# EAGLE schematic teplomer (EAGLE 7.5.0)
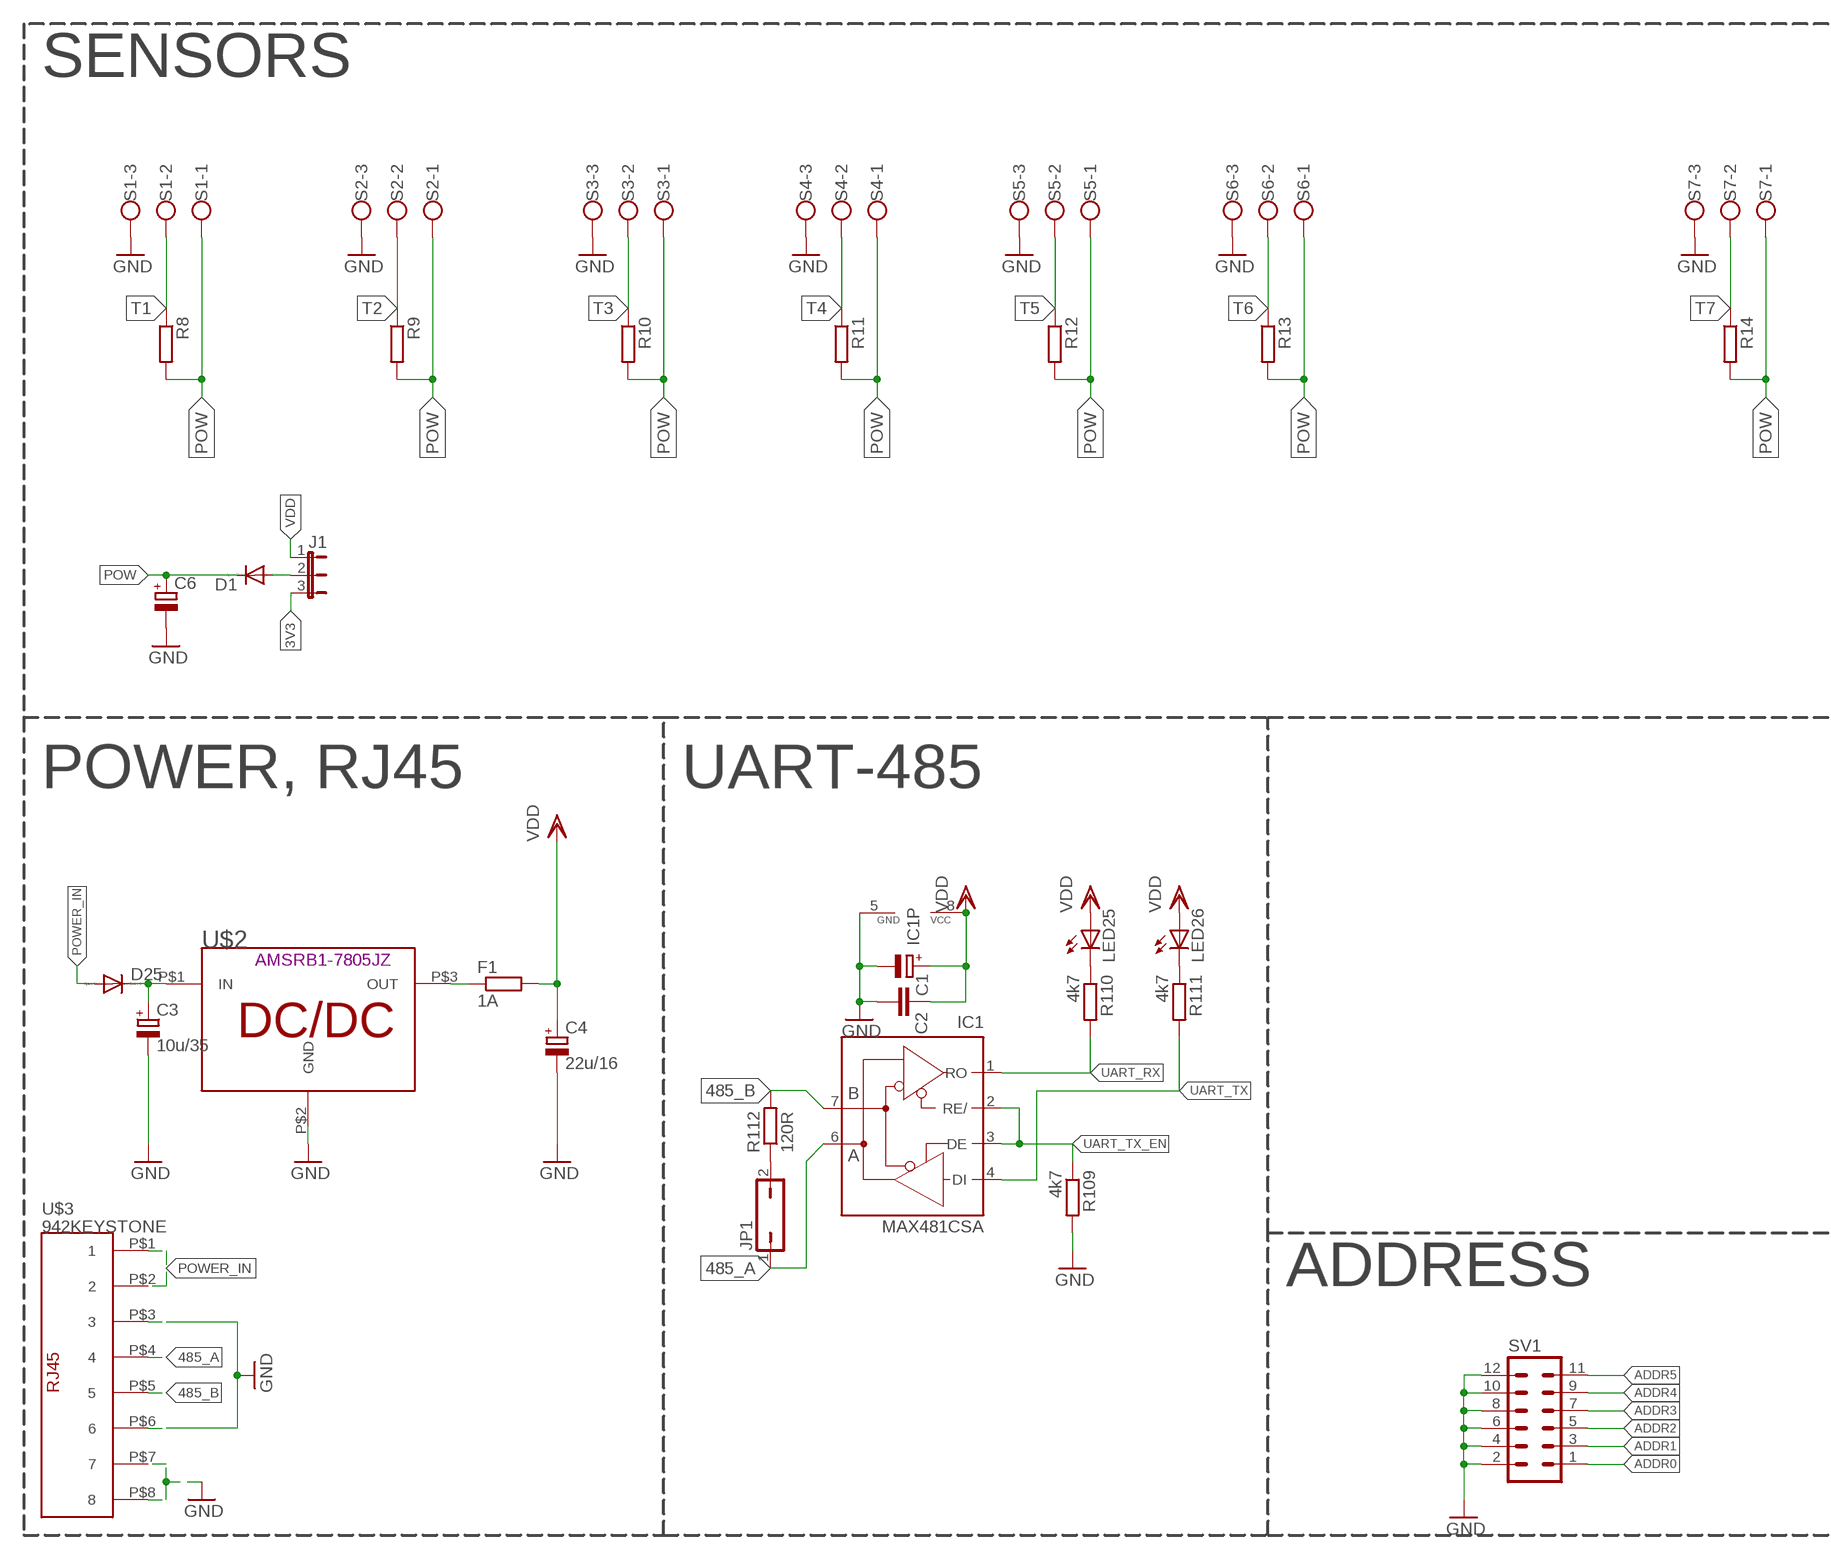
[diagram p0: schematic, sheet 1, part 1 of 2]
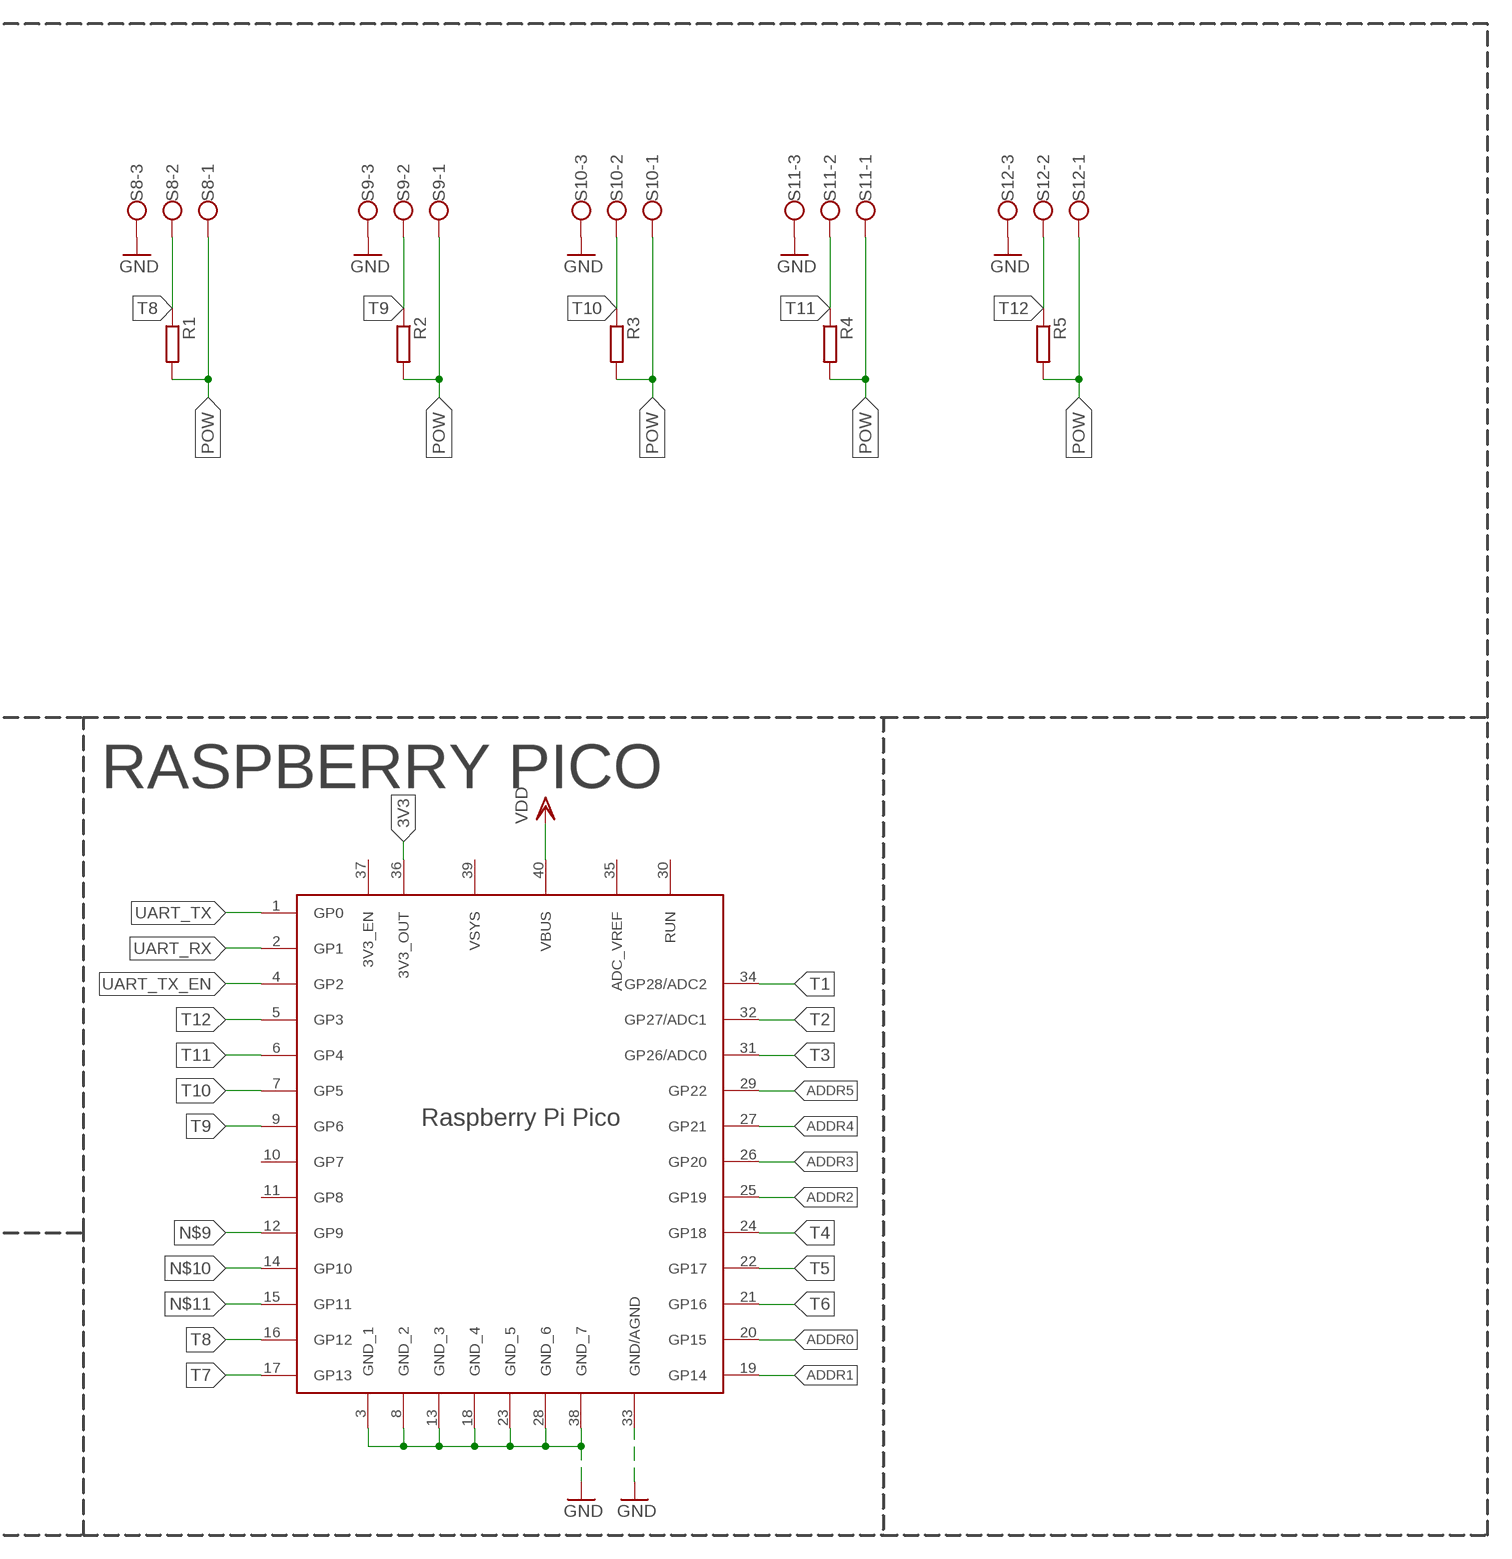
[diagram p1: schematic, sheet 1, part 2 of 2]

## Parts
C1  CPOL-EUCT3528  [CT3528]
C2  C-EUC1206  [C1206]
C3  10u/35  CPOL-EUE3.5-8  [E3,5-8]
C4  22u/16  CPOL-EUE2.5-7  [E2,5-7]
C6  CPOL-EUCT3528  [CT3528]
D1  DIODE-DO-214AC  [DO-214AC]
D25  DIODE-DO-214AC  [DO-214AC]
F1  1A  R-EU_R2512  [R2512]
IC1  MAX481CSA  [SO08]
J1  JP2W  [JP2W]
JP1  JP1Q  [JP1]
LED25  LEDKA-3528ASYC  [KA-3528ASYC]
LED26  LEDKA-3528ASYC  [KA-3528ASYC]
R1  R-EU_R0805  [R0805]
R2  R-EU_R0805  [R0805]
R3  R-EU_R0805  [R0805]
R4  R-EU_R0805  [R0805]
R5  R-EU_R0805  [R0805]
R8  R-EU_R0805  [R0805]
R9  R-EU_R0805  [R0805]
R10  R-EU_R0805  [R0805]
R11  R-EU_R0805  [R0805]
R12  R-EU_R0805  [R0805]
R13  R-EU_R0805  [R0805]
R14  R-EU_R0805  [R0805]
R109  4k7  R-EU_M1206  [M1206]
R110  4k7  R-EU_M1206  [M1206]
R111  4k7  R-EU_M1206  [M1206]
R112  120R  R-EU_M1206  [M1206]
S1  W237-103  [W237-103]
S2  W237-103  [W237-103]
S3  W237-103  [W237-103]
S4  W237-103  [W237-103]
S5  W237-103  [W237-103]
S6  W237-103  [W237-103]
S7  W237-103  [W237-103]
S8  W237-103  [W237-103]
S9  W237-103  [W237-103]
S10  W237-103  [W237-103]
S11  W237-103  [W237-103]
S12  W237-103  [W237-103]
SV1  MA06-2  [MA06-2]
U$1  RASPBERRY_PI_PICO  [RASPBERRY_PI_PICO]
U$2  AIMTEC  [AIMTEC]
U$3  942KEYSTONE  RJ45  [RJ45]

## Nets
3V3: J1.3 U$1.36(3V3_OUT)
485_A: IC1.6(A) JP1.1 U$3.P$4
485_B: IC1.7(B) R112.2 U$3.P$5
ADDR0: SV1.1 U$1.20(GP15)
ADDR1: SV1.3 U$1.19(GP14)
ADDR2: SV1.5 U$1.25(GP19)
ADDR3: SV1.7 U$1.26(GP20)
ADDR4: SV1.9 U$1.27(GP21)
ADDR5: SV1.11 U$1.29(GP22)
GND: C1.- C2.2 C3.- C4.- C6.- IC1.5(GND) R109.2 S1.3 S2.3 S3.3 S4.3 S5.3 S6.3 S7.3 S8.3 S9.3 S10.3 S11.3 S12.3 SV1.2 SV1.4 SV1.6 SV1.8 SV1.10 SV1.12 U$1.3(GND_1) U$1.8(GND_2) U$1.13(GND_3) U$1.18(GND_4) U$1.23(GND_5) U$1.28(GND_6) U$1.33(GND/AGND) U$1.38(GND_7) U$2.P$2(GND) U$3.P$3 U$3.P$7 U$3.P$8
N$1: C3.+ D25.C U$2.P$1(IN)
N$2: D1.A J1.2
N$9: U$1.12(GP9)
N$10: U$1.14(GP10)
N$11: U$1.15(GP11)
N$133: LED25.C R110.1
N$134: LED26.C R111.1
N$135: F1.1 U$2.P$3(OUT)
N$136: JP1.2 R112.1
N$138: U$3.P$6
POW: C6.+ D1.C R1.2 R2.2 R3.2 R4.2 R5.2 R8.2 R9.2 R10.2 R11.2 R12.2 R13.2 R14.2 S1.1 S2.1 S3.1 S4.1 S5.1 S6.1 S7.1 S8.1 S9.1 S10.1 S11.1 S12.1
POWER_IN: D25.A U$3.P$1 U$3.P$2
T1: R8.1 S1.2 U$1.34(GP28/ADC2)
T2: R9.1 S2.2 U$1.32(GP27/ADC1)
T3: R10.1 S3.2 U$1.31(GP26/ADC0)
T4: R11.1 S4.2 U$1.24(GP18)
T5: R12.1 S5.2 U$1.22(GP17)
T6: R13.1 S6.2 U$1.21(GP16)
T7: R14.1 S7.2 U$1.17(GP13)
T8: R1.1 S8.2 U$1.16(GP12)
T9: R2.1 S9.2 U$1.9(GP6)
T10: R3.1 S10.2 U$1.7(GP5)
T11: R4.1 S11.2 U$1.6(GP4)
T12: R5.1 S12.2 U$1.5(GP3)
UART_RX: IC1.1(RO) R110.2 U$1.2(GP1)
UART_TX: IC1.4(DI) R111.2 U$1.1(GP0)
UART_TX_EN: IC1.2(RE/) IC1.3(DE) R109.1 U$1.4(GP2)
VDD: C1.+ C2.1 C4.+ F1.2 IC1.8(VCC) J1.1 LED25.A LED26.A U$1.40(VBUS)
Unconnected: U$1.10(GP7) U$1.11(GP8) U$1.30(RUN) U$1.35(ADC_VREF) U$1.37(3V3_EN) U$1.39(VSYS)

## Notes on the sheet
- SENSORS
- POWER, RJ45 | UART-485 | RASPBERRY PICO
- AMSRB1-7805JZ
- ADDRESS

## Library data of the parts
C1 C3 C4 C6 = rcl:CPOL-EU: POLARIZED CAPACITOR, European symbol
C2 = resistor:C-EU: CAPACITOR, European symbol
D1 D25 = diode:DIODE-: DIODE
F1 R1-R5 R8-R14 R109-R112 = rcl:R-EU_: RESISTOR, European symbol
IC1 = maxim:MAX481CSA: RS485 TRANSEIVER; MF: MAXIM; MPN: MAX481CSA; OC_FARNELL: unknown; OC_NEWARK: 90C3817
J1 = jumper:JP2W: JUMPER
JP1 = jumper:JP1Q: JUMPER
LED25 LED26 = led:LED: LED OSRAM: - CHIPLED LG R971, LG N971, LY N971, LG Q971, LY Q971, LO R971, LY R971 LH N974, LH R974 LS Q976, LO Q976, LY Q976 LO Q996 - Hyper CHIPLED LW Q18S LB Q993, LB Q99A, LB R99A - SideLED LS A670, LO A670, LY A670, LG A670, LP A670 LB A673, LV A673, LT A673, LW A673 LH A674 LY A675 LS A676, LA A676, LO A676, LY A676, LW A676 LS A679, LY A679, LG A679 - Hyper Micro SIDELED® LS Y876, LA Y876, LO Y876, LY Y876 LT Y87S - SmartLED LW L88C, LW L88S LB L89C, LB L89S, LG L890 LS L89K, LO L89K, LY L89K LS L896, LA L896, LO L896, LY L896 - TOPLED LS T670, LO T670, LY T670, LG T670, LP T670 LSG T670, LSP T670, LSY T670, LOP T670, LYG T670 LG T671, LOG T671, LSG T671 LB T673, LV T673, LT T673, LW T673 LH T674 LS T676, LA T676, LO T676, LY T676, LB T676, LH T676, LSB T676, LW T676 LB T67C, LV T67C, LT T67C, LS T67K, LO T67K, LY T67K, LW E67C LS E67B, LA E67B, LO E67B, LY E67B, LB E67C, LV E67C, LT E67C LW T67C LS T679, LY T679, LG T679 LS T770, LO T770, LY T770, LG T770, LP T770 LB T773, LV T773, LT T773, LW T773 LH T774 LS E675, LA E675, LY E675, LS T675 LS T776, LA T776, LO T776, LY T776, LB T776 LHGB T686 LT T68C, LB T68C - Hyper Mini TOPLED® LB M676 - Mini TOPLED Santana® LG M470 LS M47K, LO M47K, LY M47K Source: http://www.osram.convergy.de LUXEON: - LUMILED® LXK2-PW12-R00, LXK2-PW12-S00, LXK2-PW14-U00, LXK2-PW14-V00 LXK2-PM12-R00, LXK2-PM12-S00, LXK2-PM14-U00 LXK2-PE12-Q00, LXK2-PE12-R00, LXK2-PE12-S00, LXK2-PE14-T00, LXK2-PE14-U00 LXK2-PB12-K00, LXK2-PB12-L00, LXK2-PB12-M00, LXK2-PB14-N00, LXK2-PB14-P00, LXK2-PB14-Q00 LXK2-PR12-L00, LXK2-PR12-M00, LXK2-PR14-Q00, LXK2-PR14-R00 LXK2-PD12-Q00, LXK2-PD12-R00, LXK2-PD12-S00 LXK2-PH12-R00, LXK2-PH12-S00 LXK2-PL12-P00, LXK2-PL12-Q00, LXK2-PL12-R00 Source: www.luxeon.com KINGBRIGHT: KA-3528ASYC Source: www.kingbright.com
S1-S12 = con-wago-500:W237-103: WAGO SCREW CLAMP; MPN: 237-103; OC_FARNELL: unknown; OC_NEWARK: 18M7116
SV1 = con-lstb:MA06-2: PIN HEADER; OC_FARNELL: unknown; OC_NEWARK: unknown
U$1 = sonda:RASPBERRY_PI_PICO
U$2 = sonda:AIMTEC
U$3 = sonda:RJ45